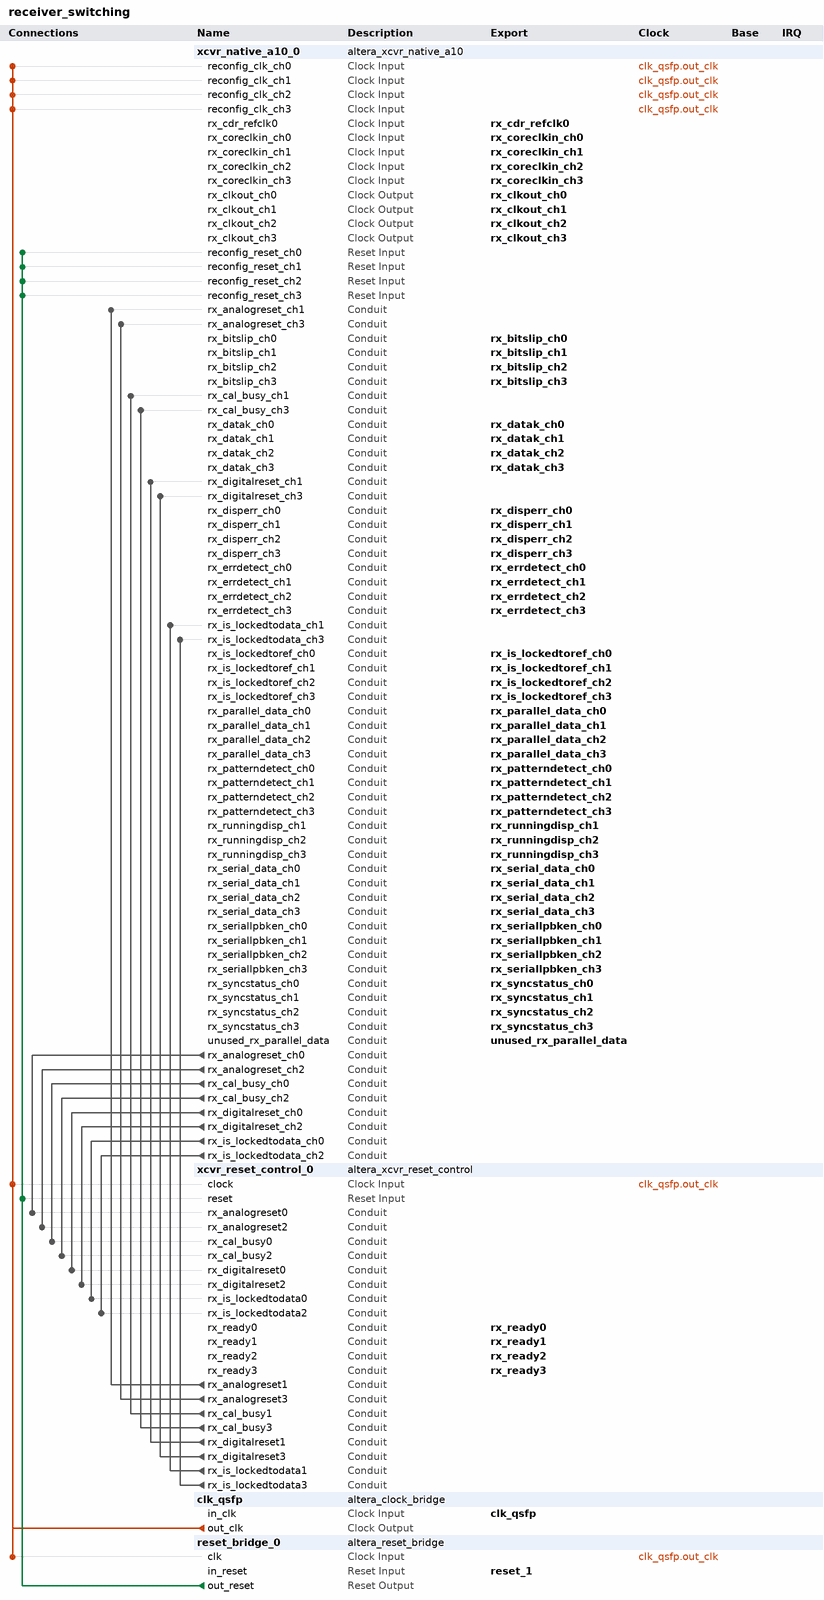
[diagram p0: system contents]
# Platform Designer (Qsys) system receiver_switching, Arria 10 10AX115N2F45E1SG
# Parameters at their usual value, and those the tool derives, are not listed.
package require -exact qsys 18.1
create_system receiver_switching
set_project_property DEVICE_FAMILY {Arria 10}
set_project_property DEVICE 10AX115N2F45E1SG

add_instance xcvr_native_a10_0 altera_xcvr_native_a10 18.1
set_instance_parameter_value xcvr_native_a10_0 anlg_voltage 1_0V
set_instance_parameter_value xcvr_native_a10_0 base_device NIGHTFURY5
set_instance_parameter_value xcvr_native_a10_0 bonded_mode not_bonded
set_instance_parameter_value xcvr_native_a10_0 channels 4
set_instance_parameter_value xcvr_native_a10_0 design_environment QSYS
set_instance_parameter_value xcvr_native_a10_0 disable_continuous_dfe false
set_instance_parameter_value xcvr_native_a10_0 duplex_mode rx
set_instance_parameter_value xcvr_native_a10_0 enable_pcie_data_mask_option 0
set_instance_parameter_value xcvr_native_a10_0 enable_pcie_dfe_ip false
set_instance_parameter_value xcvr_native_a10_0 enable_port_rx_analog_reset_ack 0
set_instance_parameter_value xcvr_native_a10_0 enable_port_rx_enh_bitslip 0
set_instance_parameter_value xcvr_native_a10_0 enable_port_rx_enh_blk_lock 0
set_instance_parameter_value xcvr_native_a10_0 enable_port_rx_enh_clr_errblk_count 0
set_instance_parameter_value xcvr_native_a10_0 enable_port_rx_enh_data_valid 0
set_instance_parameter_value xcvr_native_a10_0 enable_port_rx_enh_fifo_full 0
set_instance_parameter_value xcvr_native_a10_0 enable_port_rx_enh_fifo_rd_en 0
set_instance_parameter_value xcvr_native_a10_0 enable_port_rx_pma_clkout 0
set_instance_parameter_value xcvr_native_a10_0 enable_port_rx_pma_div_clkout 0
set_instance_parameter_value xcvr_native_a10_0 enable_port_rx_polinv 0
set_instance_parameter_value xcvr_native_a10_0 enable_port_rx_seriallpbken_tx 0
set_instance_parameter_value xcvr_native_a10_0 enable_port_rx_std_bitslip 1
set_instance_parameter_value xcvr_native_a10_0 enable_port_tx_analog_reset_ack 0
set_instance_parameter_value xcvr_native_a10_0 enable_port_tx_enh_fifo_full 0
set_instance_parameter_value xcvr_native_a10_0 enable_port_tx_enh_fifo_pfull 0
set_instance_parameter_value xcvr_native_a10_0 enable_port_tx_pma_clkout 0
set_instance_parameter_value xcvr_native_a10_0 enable_port_tx_pma_div_clkout 0
set_instance_parameter_value xcvr_native_a10_0 enable_port_tx_polinv 0
set_instance_parameter_value xcvr_native_a10_0 enable_ports_rx_manual_cdr_mode 0
set_instance_parameter_value xcvr_native_a10_0 enable_simple_interface 1
set_instance_parameter_value xcvr_native_a10_0 enable_skp_ports 0
set_instance_parameter_value xcvr_native_a10_0 enh_pcs_pma_width 64
set_instance_parameter_value xcvr_native_a10_0 enh_pld_pcs_width 64
set_instance_parameter_value xcvr_native_a10_0 enh_rx_blksync_enable 0
set_instance_parameter_value xcvr_native_a10_0 enh_rx_descram_enable 0
set_instance_parameter_value xcvr_native_a10_0 enh_rxfifo_mode {Phase compensation}
set_instance_parameter_value xcvr_native_a10_0 enh_tx_scram_enable 0
set_instance_parameter_value xcvr_native_a10_0 enh_tx_scram_seed 0
set_instance_parameter_value xcvr_native_a10_0 enh_txfifo_mode {Phase compensation}
set_instance_parameter_value xcvr_native_a10_0 generate_add_hdl_instance_example 0
set_instance_parameter_value xcvr_native_a10_0 generate_docs 1
set_instance_parameter_value xcvr_native_a10_0 protocol_mode basic_std
set_instance_parameter_value xcvr_native_a10_0 rcfg_file_prefix altera_xcvr_native_a10
set_instance_parameter_value xcvr_native_a10_0 rcfg_h_file_enable 0
set_instance_parameter_value xcvr_native_a10_0 rcfg_iface_enable 0
set_instance_parameter_value xcvr_native_a10_0 rcfg_jtag_enable 0
set_instance_parameter_value xcvr_native_a10_0 rcfg_mif_file_enable 0
set_instance_parameter_value xcvr_native_a10_0 rcfg_multi_enable 0
set_instance_parameter_value xcvr_native_a10_0 rcfg_profile_cnt 2
set_instance_parameter_value xcvr_native_a10_0 rcfg_profile_select 1
set_instance_parameter_value xcvr_native_a10_0 rcfg_reduced_files_enable 0
set_instance_parameter_value xcvr_native_a10_0 rcfg_separate_avmm_busy 0
set_instance_parameter_value xcvr_native_a10_0 rcfg_shared 0
set_instance_parameter_value xcvr_native_a10_0 rcfg_sv_file_enable 0
set_instance_parameter_value xcvr_native_a10_0 rx_pma_div_clkout_divider 0
set_instance_parameter_value xcvr_native_a10_0 set_capability_reg_enable 0
set_instance_parameter_value xcvr_native_a10_0 set_cdr_refclk_freq 125.000000
set_instance_parameter_value xcvr_native_a10_0 set_csr_soft_logic_enable 0
set_instance_parameter_value xcvr_native_a10_0 set_data_rate 6250
set_instance_parameter_value xcvr_native_a10_0 set_disconnect_analog_resets 0
set_instance_parameter_value xcvr_native_a10_0 set_odi_soft_logic_enable 0
set_instance_parameter_value xcvr_native_a10_0 set_prbs_soft_logic_enable 0
set_instance_parameter_value xcvr_native_a10_0 sim_reduced_counters false
set_instance_parameter_value xcvr_native_a10_0 std_data_mask_count_multi 0
set_instance_parameter_value xcvr_native_a10_0 std_pcs_pma_width 20
set_instance_parameter_value xcvr_native_a10_0 std_rx_8b10b_enable 1
set_instance_parameter_value xcvr_native_a10_0 std_rx_byte_deser_mode {Deserialize x2}
set_instance_parameter_value xcvr_native_a10_0 std_rx_polinv_enable 0
set_instance_parameter_value xcvr_native_a10_0 std_rx_word_aligner_mode {synchronous state machine}
set_instance_parameter_value xcvr_native_a10_0 std_rx_word_aligner_pattern 643
set_instance_parameter_value xcvr_native_a10_0 std_rx_word_aligner_pattern_len 10
set_instance_parameter_value xcvr_native_a10_0 std_tx_8b10b_enable 0
set_instance_parameter_value xcvr_native_a10_0 std_tx_byte_ser_mode Disabled
set_instance_parameter_value xcvr_native_a10_0 std_tx_polinv_enable 0
set_instance_parameter_value xcvr_native_a10_0 tx_pma_div_clkout_divider 0

add_instance xcvr_reset_control_0 altera_xcvr_reset_control 18.1
set_instance_parameter_value xcvr_reset_control_0 CHANNELS 4
set_instance_parameter_value xcvr_reset_control_0 RX_PER_CHANNEL 1
set_instance_parameter_value xcvr_reset_control_0 SYS_CLK_IN_MHZ 125
set_instance_parameter_value xcvr_reset_control_0 TX_ENABLE 0
set_instance_parameter_value xcvr_reset_control_0 TX_PLL_ENABLE 0
set_instance_parameter_value xcvr_reset_control_0 T_RX_ANALOGRESET 70000
set_instance_parameter_value xcvr_reset_control_0 T_TX_ANALOGRESET 70000
set_instance_parameter_value xcvr_reset_control_0 T_TX_DIGITALRESET 70000
set_instance_parameter_value xcvr_reset_control_0 gui_pll_cal_busy 0
set_instance_parameter_value xcvr_reset_control_0 gui_split_interfaces 1

add_instance clk_qsfp altera_clock_bridge 18.1
set_instance_parameter_value clk_qsfp DERIVED_CLOCK_RATE 0
set_instance_parameter_value clk_qsfp EXPLICIT_CLOCK_RATE 130000000

add_instance reset_bridge_0 altera_reset_bridge 18.1
set_instance_parameter_value reset_bridge_0 ACTIVE_LOW_RESET 0
set_instance_parameter_value reset_bridge_0 SYNCHRONOUS_EDGES deassert

# connections
add_connection clk_qsfp.out_clk reset_bridge_0.clk clock
add_connection clk_qsfp.out_clk xcvr_native_a10_0.reconfig_clk_ch0 clock
add_connection clk_qsfp.out_clk xcvr_native_a10_0.reconfig_clk_ch1 clock
add_connection clk_qsfp.out_clk xcvr_native_a10_0.reconfig_clk_ch2 clock
add_connection clk_qsfp.out_clk xcvr_native_a10_0.reconfig_clk_ch3 clock
add_connection clk_qsfp.out_clk xcvr_reset_control_0.clock clock
add_connection reset_bridge_0.out_reset xcvr_native_a10_0.reconfig_reset_ch0 reset
add_connection reset_bridge_0.out_reset xcvr_native_a10_0.reconfig_reset_ch1 reset
add_connection reset_bridge_0.out_reset xcvr_native_a10_0.reconfig_reset_ch2 reset
add_connection reset_bridge_0.out_reset xcvr_native_a10_0.reconfig_reset_ch3 reset
add_connection reset_bridge_0.out_reset xcvr_reset_control_0.reset reset
add_connection xcvr_native_a10_0.rx_analogreset_ch0 xcvr_reset_control_0.rx_analogreset0 conduit
add_connection xcvr_native_a10_0.rx_analogreset_ch2 xcvr_reset_control_0.rx_analogreset2 conduit
add_connection xcvr_native_a10_0.rx_cal_busy_ch0 xcvr_reset_control_0.rx_cal_busy0 conduit
add_connection xcvr_native_a10_0.rx_cal_busy_ch2 xcvr_reset_control_0.rx_cal_busy2 conduit
add_connection xcvr_native_a10_0.rx_digitalreset_ch0 xcvr_reset_control_0.rx_digitalreset0 conduit
add_connection xcvr_native_a10_0.rx_digitalreset_ch2 xcvr_reset_control_0.rx_digitalreset2 conduit
add_connection xcvr_native_a10_0.rx_is_lockedtodata_ch0 xcvr_reset_control_0.rx_is_lockedtodata0 conduit
add_connection xcvr_native_a10_0.rx_is_lockedtodata_ch2 xcvr_reset_control_0.rx_is_lockedtodata2 conduit
add_connection xcvr_reset_control_0.rx_analogreset1 xcvr_native_a10_0.rx_analogreset_ch1 conduit
add_connection xcvr_reset_control_0.rx_analogreset3 xcvr_native_a10_0.rx_analogreset_ch3 conduit
add_connection xcvr_reset_control_0.rx_cal_busy1 xcvr_native_a10_0.rx_cal_busy_ch1 conduit
add_connection xcvr_reset_control_0.rx_cal_busy3 xcvr_native_a10_0.rx_cal_busy_ch3 conduit
add_connection xcvr_reset_control_0.rx_digitalreset1 xcvr_native_a10_0.rx_digitalreset_ch1 conduit
add_connection xcvr_reset_control_0.rx_digitalreset3 xcvr_native_a10_0.rx_digitalreset_ch3 conduit
add_connection xcvr_reset_control_0.rx_is_lockedtodata1 xcvr_native_a10_0.rx_is_lockedtodata_ch1 conduit
add_connection xcvr_reset_control_0.rx_is_lockedtodata3 xcvr_native_a10_0.rx_is_lockedtodata_ch3 conduit

# exported interfaces
add_interface clk_qsfp clock sink
set_interface_property clk_qsfp EXPORT_OF clk_qsfp.in_clk
add_interface reset_1 reset sink
set_interface_property reset_1 EXPORT_OF reset_bridge_0.in_reset
add_interface rx_bitslip_ch0 conduit end
set_interface_property rx_bitslip_ch0 EXPORT_OF xcvr_native_a10_0.rx_bitslip_ch0
add_interface rx_bitslip_ch1 conduit end
set_interface_property rx_bitslip_ch1 EXPORT_OF xcvr_native_a10_0.rx_bitslip_ch1
add_interface rx_bitslip_ch2 conduit end
set_interface_property rx_bitslip_ch2 EXPORT_OF xcvr_native_a10_0.rx_bitslip_ch2
add_interface rx_bitslip_ch3 conduit end
set_interface_property rx_bitslip_ch3 EXPORT_OF xcvr_native_a10_0.rx_bitslip_ch3
add_interface rx_cdr_refclk0 clock sink
set_interface_property rx_cdr_refclk0 EXPORT_OF xcvr_native_a10_0.rx_cdr_refclk0
add_interface rx_clkout_ch0 clock source
set_interface_property rx_clkout_ch0 EXPORT_OF xcvr_native_a10_0.rx_clkout_ch0
add_interface rx_clkout_ch1 clock source
set_interface_property rx_clkout_ch1 EXPORT_OF xcvr_native_a10_0.rx_clkout_ch1
add_interface rx_clkout_ch2 clock source
set_interface_property rx_clkout_ch2 EXPORT_OF xcvr_native_a10_0.rx_clkout_ch2
add_interface rx_clkout_ch3 clock source
set_interface_property rx_clkout_ch3 EXPORT_OF xcvr_native_a10_0.rx_clkout_ch3
add_interface rx_coreclkin_ch0 clock sink
set_interface_property rx_coreclkin_ch0 EXPORT_OF xcvr_native_a10_0.rx_coreclkin_ch0
add_interface rx_coreclkin_ch1 clock sink
set_interface_property rx_coreclkin_ch1 EXPORT_OF xcvr_native_a10_0.rx_coreclkin_ch1
add_interface rx_coreclkin_ch2 clock sink
set_interface_property rx_coreclkin_ch2 EXPORT_OF xcvr_native_a10_0.rx_coreclkin_ch2
add_interface rx_coreclkin_ch3 clock sink
set_interface_property rx_coreclkin_ch3 EXPORT_OF xcvr_native_a10_0.rx_coreclkin_ch3
add_interface rx_datak_ch0 conduit end
set_interface_property rx_datak_ch0 EXPORT_OF xcvr_native_a10_0.rx_datak_ch0
add_interface rx_datak_ch1 conduit end
set_interface_property rx_datak_ch1 EXPORT_OF xcvr_native_a10_0.rx_datak_ch1
add_interface rx_datak_ch2 conduit end
set_interface_property rx_datak_ch2 EXPORT_OF xcvr_native_a10_0.rx_datak_ch2
add_interface rx_datak_ch3 conduit end
set_interface_property rx_datak_ch3 EXPORT_OF xcvr_native_a10_0.rx_datak_ch3
add_interface rx_disperr_ch0 conduit end
set_interface_property rx_disperr_ch0 EXPORT_OF xcvr_native_a10_0.rx_disperr_ch0
add_interface rx_disperr_ch1 conduit end
set_interface_property rx_disperr_ch1 EXPORT_OF xcvr_native_a10_0.rx_disperr_ch1
add_interface rx_disperr_ch2 conduit end
set_interface_property rx_disperr_ch2 EXPORT_OF xcvr_native_a10_0.rx_disperr_ch2
add_interface rx_disperr_ch3 conduit end
set_interface_property rx_disperr_ch3 EXPORT_OF xcvr_native_a10_0.rx_disperr_ch3
add_interface rx_errdetect_ch0 conduit end
set_interface_property rx_errdetect_ch0 EXPORT_OF xcvr_native_a10_0.rx_errdetect_ch0
add_interface rx_errdetect_ch1 conduit end
set_interface_property rx_errdetect_ch1 EXPORT_OF xcvr_native_a10_0.rx_errdetect_ch1
add_interface rx_errdetect_ch2 conduit end
set_interface_property rx_errdetect_ch2 EXPORT_OF xcvr_native_a10_0.rx_errdetect_ch2
add_interface rx_errdetect_ch3 conduit end
set_interface_property rx_errdetect_ch3 EXPORT_OF xcvr_native_a10_0.rx_errdetect_ch3
add_interface rx_is_lockedtoref_ch0 conduit end
set_interface_property rx_is_lockedtoref_ch0 EXPORT_OF xcvr_native_a10_0.rx_is_lockedtoref_ch0
add_interface rx_is_lockedtoref_ch1 conduit end
set_interface_property rx_is_lockedtoref_ch1 EXPORT_OF xcvr_native_a10_0.rx_is_lockedtoref_ch1
add_interface rx_is_lockedtoref_ch2 conduit end
set_interface_property rx_is_lockedtoref_ch2 EXPORT_OF xcvr_native_a10_0.rx_is_lockedtoref_ch2
add_interface rx_is_lockedtoref_ch3 conduit end
set_interface_property rx_is_lockedtoref_ch3 EXPORT_OF xcvr_native_a10_0.rx_is_lockedtoref_ch3
add_interface rx_parallel_data_ch0 conduit end
set_interface_property rx_parallel_data_ch0 EXPORT_OF xcvr_native_a10_0.rx_parallel_data_ch0
add_interface rx_parallel_data_ch1 conduit end
set_interface_property rx_parallel_data_ch1 EXPORT_OF xcvr_native_a10_0.rx_parallel_data_ch1
add_interface rx_parallel_data_ch2 conduit end
set_interface_property rx_parallel_data_ch2 EXPORT_OF xcvr_native_a10_0.rx_parallel_data_ch2
add_interface rx_parallel_data_ch3 conduit end
set_interface_property rx_parallel_data_ch3 EXPORT_OF xcvr_native_a10_0.rx_parallel_data_ch3
add_interface rx_patterndetect_ch0 conduit end
set_interface_property rx_patterndetect_ch0 EXPORT_OF xcvr_native_a10_0.rx_patterndetect_ch0
add_interface rx_patterndetect_ch1 conduit end
set_interface_property rx_patterndetect_ch1 EXPORT_OF xcvr_native_a10_0.rx_patterndetect_ch1
add_interface rx_patterndetect_ch2 conduit end
set_interface_property rx_patterndetect_ch2 EXPORT_OF xcvr_native_a10_0.rx_patterndetect_ch2
add_interface rx_patterndetect_ch3 conduit end
set_interface_property rx_patterndetect_ch3 EXPORT_OF xcvr_native_a10_0.rx_patterndetect_ch3
add_interface rx_ready0 conduit end
set_interface_property rx_ready0 EXPORT_OF xcvr_reset_control_0.rx_ready0
add_interface rx_ready1 conduit end
set_interface_property rx_ready1 EXPORT_OF xcvr_reset_control_0.rx_ready1
add_interface rx_ready2 conduit end
set_interface_property rx_ready2 EXPORT_OF xcvr_reset_control_0.rx_ready2
add_interface rx_ready3 conduit end
set_interface_property rx_ready3 EXPORT_OF xcvr_reset_control_0.rx_ready3
add_interface rx_runningdisp_ch1 conduit end
set_interface_property rx_runningdisp_ch1 EXPORT_OF xcvr_native_a10_0.rx_runningdisp_ch1
add_interface rx_runningdisp_ch2 conduit end
set_interface_property rx_runningdisp_ch2 EXPORT_OF xcvr_native_a10_0.rx_runningdisp_ch2
add_interface rx_runningdisp_ch3 conduit end
set_interface_property rx_runningdisp_ch3 EXPORT_OF xcvr_native_a10_0.rx_runningdisp_ch3
add_interface rx_serial_data_ch0 conduit end
set_interface_property rx_serial_data_ch0 EXPORT_OF xcvr_native_a10_0.rx_serial_data_ch0
add_interface rx_serial_data_ch1 conduit end
set_interface_property rx_serial_data_ch1 EXPORT_OF xcvr_native_a10_0.rx_serial_data_ch1
add_interface rx_serial_data_ch2 conduit end
set_interface_property rx_serial_data_ch2 EXPORT_OF xcvr_native_a10_0.rx_serial_data_ch2
add_interface rx_serial_data_ch3 conduit end
set_interface_property rx_serial_data_ch3 EXPORT_OF xcvr_native_a10_0.rx_serial_data_ch3
add_interface rx_seriallpbken_ch0 conduit end
set_interface_property rx_seriallpbken_ch0 EXPORT_OF xcvr_native_a10_0.rx_seriallpbken_ch0
add_interface rx_seriallpbken_ch1 conduit end
set_interface_property rx_seriallpbken_ch1 EXPORT_OF xcvr_native_a10_0.rx_seriallpbken_ch1
add_interface rx_seriallpbken_ch2 conduit end
set_interface_property rx_seriallpbken_ch2 EXPORT_OF xcvr_native_a10_0.rx_seriallpbken_ch2
add_interface rx_seriallpbken_ch3 conduit end
set_interface_property rx_seriallpbken_ch3 EXPORT_OF xcvr_native_a10_0.rx_seriallpbken_ch3
add_interface rx_syncstatus_ch0 conduit end
set_interface_property rx_syncstatus_ch0 EXPORT_OF xcvr_native_a10_0.rx_syncstatus_ch0
add_interface rx_syncstatus_ch1 conduit end
set_interface_property rx_syncstatus_ch1 EXPORT_OF xcvr_native_a10_0.rx_syncstatus_ch1
add_interface rx_syncstatus_ch2 conduit end
set_interface_property rx_syncstatus_ch2 EXPORT_OF xcvr_native_a10_0.rx_syncstatus_ch2
add_interface rx_syncstatus_ch3 conduit end
set_interface_property rx_syncstatus_ch3 EXPORT_OF xcvr_native_a10_0.rx_syncstatus_ch3
add_interface unused_rx_parallel_data conduit end
set_interface_property unused_rx_parallel_data EXPORT_OF xcvr_native_a10_0.unused_rx_parallel_data

set_interconnect_requirement {$system} qsys_mm.clockCrossingAdapter HANDSHAKE
set_interconnect_requirement {$system} qsys_mm.enableEccProtection FALSE
set_interconnect_requirement {$system} qsys_mm.insertDefaultSlave FALSE
set_interconnect_requirement {$system} qsys_mm.maxAdditionalLatency 1

save_system receiver_switching.qsys
